# Altium schematic sheet main_transformer V3.SchDoc
size A4
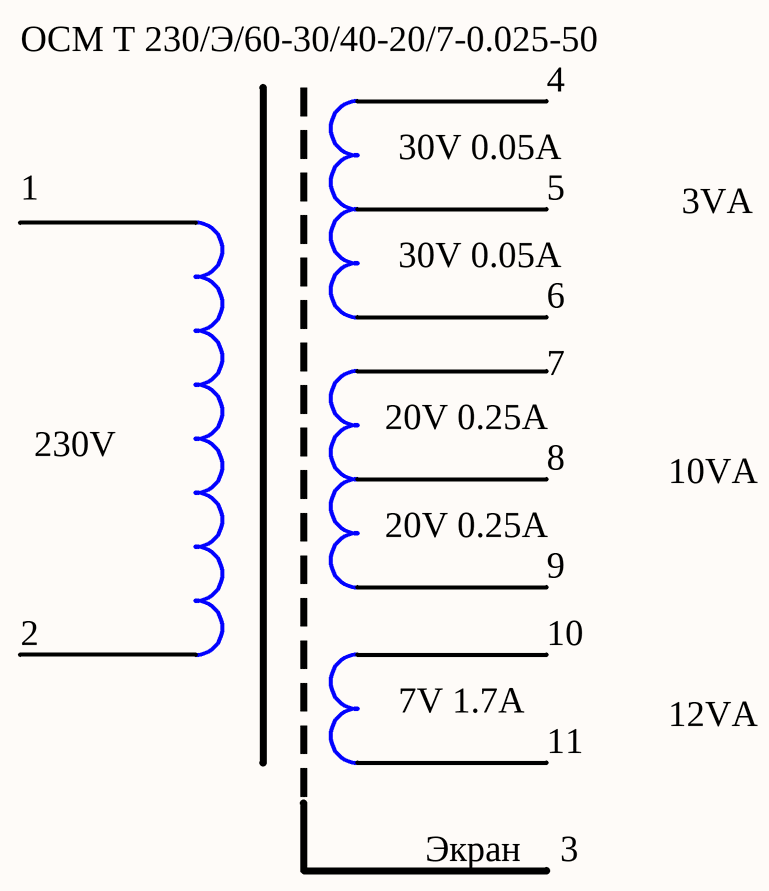
[diagram p0: main_transformer V3.SchDoc]

## Notes on the sheet
- ОСМ Т 230/Э/60-30/40-20/7-0.025-50
- 4
- 1
- 30V 0.05A
- 5
- 3VA
- 6
- 7
- 230V
- 20V 0.25A
- 8
- 10VA
- 9
- 2
- 10
- 7V 1.7A
- 11
- 12VA
- Экран
- 3